# Altium schematic sheet WGA_IR.SchDoc
size A3
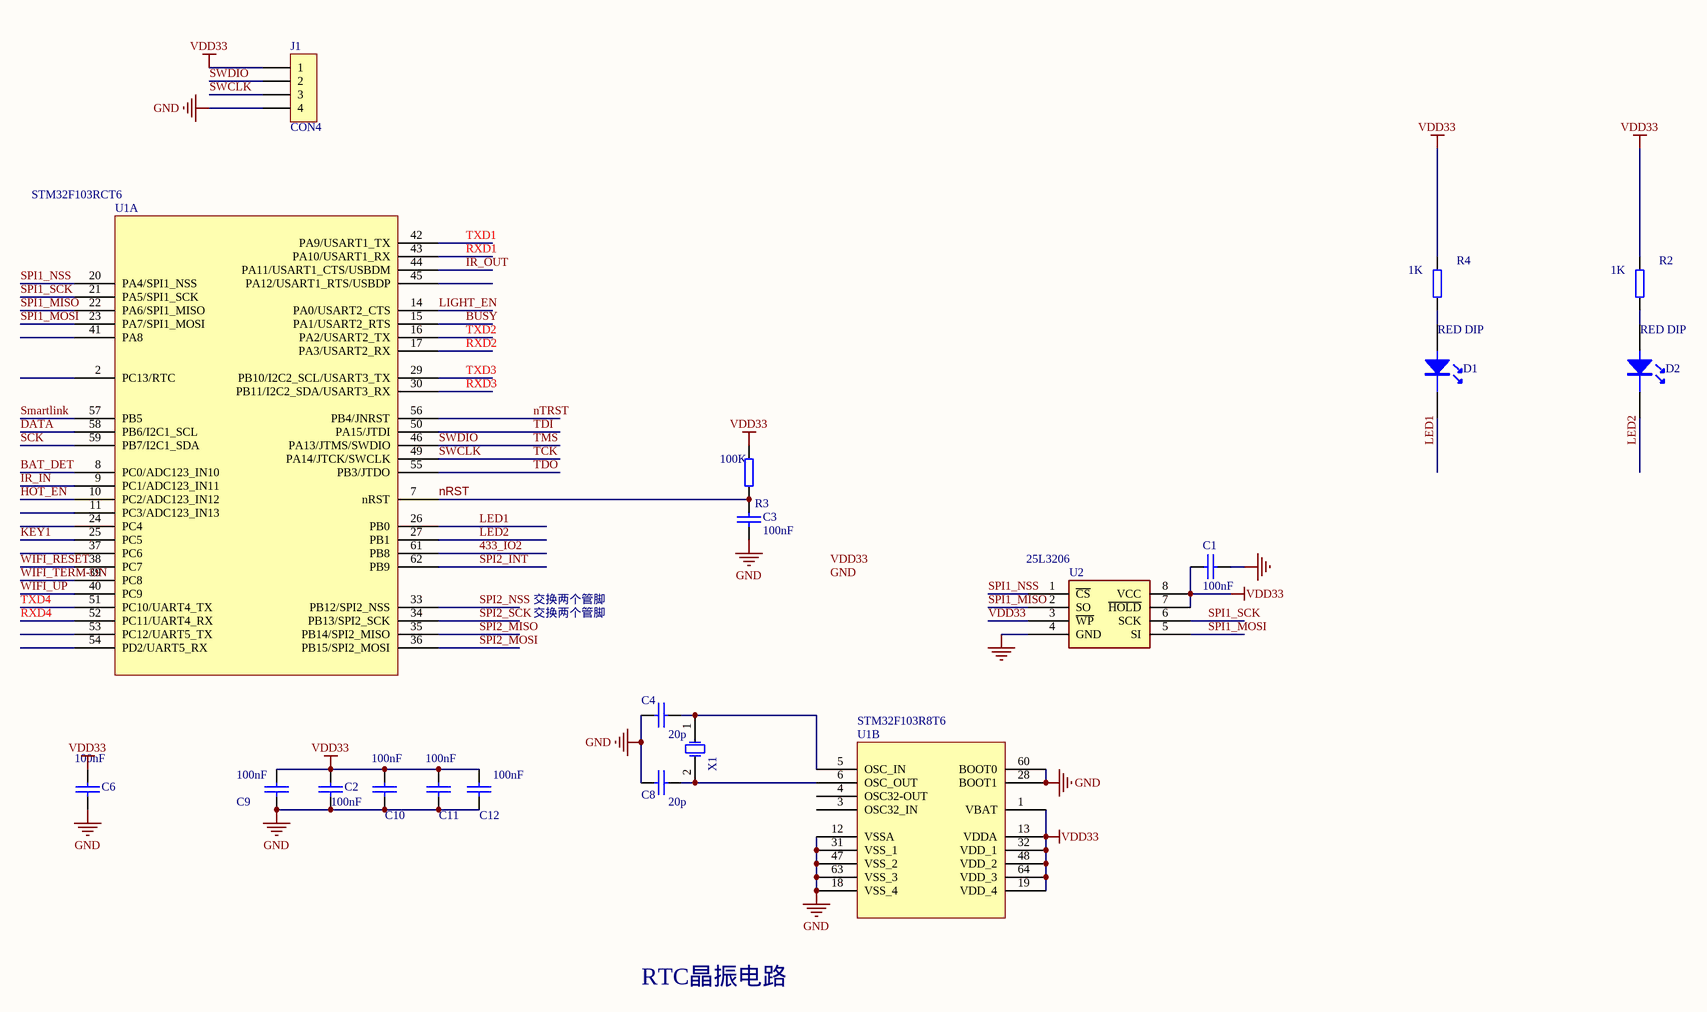
[diagram p0: WGA_IR.SchDoc]

## Parts
C1  value 100nF  [C0603]  (hidden comment: CC0603ZRY5V9BB104)
C2  value 100nF  [C0603]  (hidden comment: CC0603ZRY5V9BB104)
C3  value 100nF  [C0603]  (hidden comment: CC0603ZRY5V9BB104)
C4  value 20p  [C0603]  (hidden comment: CC0603JRNPO9BN200)
C6  value 100nF  [C0603]  (hidden comment: CC0603ZRY5V9BB104)
C8  value 20p  [C0603]  (hidden comment: CC0603JRNPO9BN200)
C9  value 100nF  [C0603]  (hidden comment: CC0603ZRY5V9BB104)
C10  value 100nF  [C0603]  (hidden comment: CC0603ZRY5V9BB104)
C11  value 100nF  [C0603]  (hidden comment: CC0603ZRY5V9BB104)
C12  value 100nF  [C0603]  (hidden comment: CC0603ZRY5V9BB104)
D1  value RED DIP  [T1-3MM_N]  (hidden comment: VLMS1300-GS08)
D2  value RED DIP  [T1-3MM_N]  (hidden comment: VLMS1300-GS08)
J1  CON4  [SIP4]
R2  value 1K  [R0603]  (hidden comment: RC0603JR-071KL)
R3  value 100K  [R0603]  (hidden comment: RC0603JR-07100KL)
R4  value 1K  [R0603]  (hidden comment: RC0603JR-071KL)
U1  STM32F103RCT6  [LQFP64]  (parts A,B of 2)
U2  value 25L3206  [SSOP8]  (hidden comment: MX25L3206EM2I-12G)
X1  9C-8.000MBBK-T  [XTAL2]  (value not drawn)

## Nets
GND: C1.2 C2.2 C3.1 C4.1 C6.2 C8.1 C9.2 C10.2 C11.2 C12.2 J1.4 U1.12(VSSA) U1.18(VSS_4) U1.28(BOOT1) U1.31(VSS_1) U1.47(VSS_2) U1.60(BOOT0) U1.63(VSS_3) U2.4(GND)
VDD33: C1.1 C2.1 C6.1 C9.1 C10.1 C11.1 C12.1 J1.1 R2.2 R3.2 R4.2 U1.1(VBAT) U1.13(VDDA) U1.19(VDD_4) U1.32(VDD_1) U1.48(VDD_2) U1.64(VDD_3) U2.3(~{WP}) U2.7(~{HOLD}) U2.8(VCC)
433_IO2: U1.61(PB8)
BAT_DET: U1.8(PC0/ADC123_IN10)
BUSY: U1.15(PA1/USART2_RTS)
DATA: U1.58(PB6/I2C1_SCL)
HOT_EN: U1.10(PC2/ADC123_IN12)
IR_IN: U1.9(PC1/ADC123_IN11)
IR_OUT: U1.44(PA11/USART1_CTS/USBDM)
KEY1: U1.25(PC5)
LED1: D1.2 U1.26(PB0)
LED2: D2.2 U1.27(PB1)
LIGHT_EN: U1.14(PA0/USART2_CTS)
nRST: C3.2 R3.1 U1.7(nRST)
nTRST: U1.56(PB4/JNRST)
RXD1: U1.43(PA10/USART1_RX)
RXD2: U1.17(PA3/USART2_RX)
RXD3: U1.30(PB11/I2C2_SDA/USART3_RX)
RXD4: U1.52(PC11/UART4_RX)
SCK: U1.59(PB7/I2C1_SDA)
Smartlink: U1.57(PB5)
SPI1_MISO: U1.22(PA6/SPI1_MISO) U2.2(SO)
SPI1_MOSI: U1.23(PA7/SPI1_MOSI) U2.5(SI)
SPI1_NSS: U1.20(PA4/SPI1_NSS) U2.1(~{CS})
SPI1_SCK: U1.21(PA5/SPI1_SCK) U2.6(SCK)
SPI2_INT: U1.62(PB9)
SPI2_MISO: U1.35(PB14/SPI2_MISO)
SPI2_MOSI: U1.36(PB15/SPI2_MOSI)
SPI2_NSS: U1.33(PB12/SPI2_NSS)
SPI2_SCK: U1.34(PB13/SPI2_SCK)
SWCLK: J1.3 U1.49(PA14/JTCK/SWCLK)  [also labelled TCK]
SWDIO: J1.2 U1.46(PA13/JTMS/SWDIO)  [also labelled TMS]
TDI: U1.50(PA15/JTDI)
TDO: U1.55(PB3/JTDO)
TXD1: U1.42(PA9/USART1_TX)
TXD2: U1.16(PA2/USART2_TX)
TXD3: U1.29(PB10/I2C2_SCL/USART3_TX)
TXD4: U1.51(PC10/UART4_TX)
WIFI_RESET: U1.38(PC7)
WIFI_TERM-ON: U1.39(PC8)
WIFI_UP: U1.40(PC9)
NetC4_2: C4.2 U1.5(OSC_IN) X1.1(OSC1)
NetC8_2: C8.2 U1.6(OSC_OUT) X1.2(OSC2)
NetD1_1: D1.1 R4.1
NetD2_1: D2.1 R2.1

Not connected (* = marked no-connect by the designer): U1 2(PC13/RTC) 3(OSC32_IN) 4(OSC32-OUT) 11(PC3/ADC123_IN13) 24(PC4) 37(PC6) 41(PA8) 45(PA12/USART1_RTS/USBDP) 53(PC12/UART5_TX) 54(PD2/UART5_RX)

## Notes on the sheet
- 交换两个管脚
- RTC晶振电路
- Labels drawn without touching a wire or pin: GND, VDD33

## Library data of the parts
C1-C3 C6 C9-C12 = C0603_100nF: CAP CER 0.1UF 50V Y5V 0603; Manufacturer: Yageo; Unit Cost: 0.04; Category: Capacitors; Manufacturer Part Number: CC0603ZRY5V9BB104; Part Number: CC0603ZRY5V9BB104; Subcategory: Ceramic Capacitors
C4 C8 = C0603_20p: CAP CER 20PF 50V 5% NPO 0603; Manufacturer: Yageo; Unit Cost: 0.04; Category: Capacitors; Manufacturer Part Number: CC0603JRNPO9BN200; Part Number: CC0603JRNPO9BN200; RoHs: Lead free / RoHS Compliant; Subcategory: Ceramic Capacitors
D1 D2 = LED-D0603: LED SUPER RED 0603 SMD VF=2V  I=20mA; Manufacturer: Vishay Semiconductor Opto Division; Category: Optoelectronics; Manufacturer Part Number: VLMS1300-GS08; Part Number: VLMS1300-GS08; Subcategory: LED Indication - Discrete
J1 = CON4: 2.54mm dip
R2 R4 = R0603_1K_5%: RES 1.0K OHM 1/10W 5% 0603 SMD; Manufacturer: Yageo; Unit Cost: 0.005; Category: Resistor; Manufacturer Part Number: RC0603JR-071KL; Part Number: RC0603JR-071KL; RoHs: Lead free / RoHS Compliant; Subcategory: ThickFilm
R3 = R0603_100K_5%: RES 100K OHM 1/10W 5% 0603 SMD; Manufacturer: Yageo; Unit Cost: 0.005; Category: Resistor; Manufacturer Part Number: RC0603JR-07100KL; Part Number: RC0603JR-07100KL; RoHs: Lead free / RoHS Compliant; Subcategory: ThickFilm
U1 = STM32F103RC: MCU ARM 128KB FLASH MEM 64-LQFP; Manufacturer: STMicroelectronics; Unit Cost: 9.5; Category: Integrated Circuits (ICs); Manufacturer Part Number: STM32F103RCT6; Part Number: STM32F103RCT6; RoHs: Lead free / RoHS Compliant; Subcategory: STM32 F1; Value: STM32F103RCT6
U2 = 25L3206: IC FLASH 32MBIT 86MHZ 8SOP 32M (4M x 8); Manufacturer: Macronix; Category: Integrated Circuits (ICs); Manufacturer Part Number: MX25L3206EM2I-12G; Part Number: MX25L3206EM2I-12G; Subcategory: Memory
X1 = CRYSTAL-XTAL2: CRYSTAL 8.000MHZ 20PF SMD; Manufacturer: TXC CORPORATION; Value: 8M; Unit Cost: 0.25; Category: Crystals; Manufacturer Part Number: 9C-8.000MBBK-T; Part Number: 9C-8.000MBBK-T; RoHs: Lead free / RoHS Compliant; Subcategory: HC-49S